# Altium schematic sheet Sheet1.SchDoc
size A
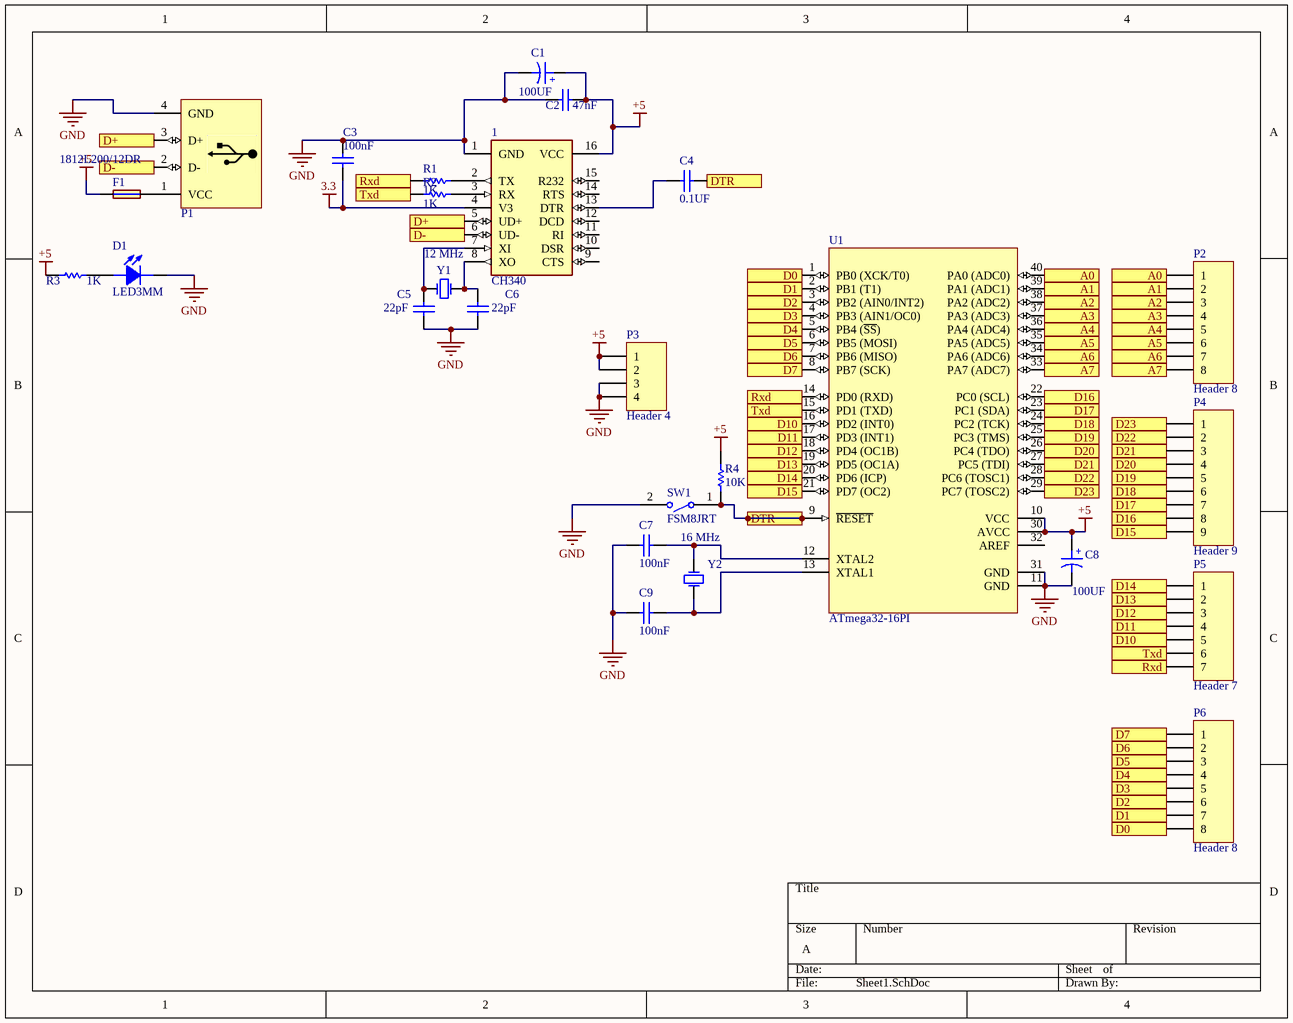
[diagram p0: Sheet1.SchDoc]

## Parts
1  CH340  [SOIC16]
C1  100UF  [Cap electrolitic radial 5x12-2]
C2  47nF  [Cap-100nF]
C3  100nF  [Cap-100nF]
C4  0.1UF  [CAPC3413X12N]
C5  22pF  [Cap-100nF]
C6  22pF  [Cap-100nF]
C7  100nF  [Cap-100nF]
C8  100UF  [Cap electrolitic radial 5x12-2]
C9  100nF  [Cap-100nF]
D1  LED3MM  [LED3mm_GRN]
F1  1812L200/12DR  [FUSE_1812L200/12DR]
P1  USB Connector  [USB2.5-2H4F]  (value not drawn)
P2  Header 8  [HDR1X8]
P3  Header 4  [HDR1X4]
P4  Header 9  [HDR1X9]
P5  Header 7  [HDR1X7]
P6  Header 8  [HDR1X8]
R1  1K  [RES1206]
R2  1K  [RES1206]
R3  1K  [RES-(1/4)]
R4  10K  [RES-(1/4)]
SW1  FSM8JRT  [TE_FSM8JRT]
U1  ATmega32-16PI  [40P6]
Y1  12 MHz  [XTAL 16MHZ]
Y2  16 MHz  [XTAL 16MHZ]

## Ports
A0, A1, A2, A3, A4, A5, A6, A7, D0, D1, D2, D3, D4, D5, D6, D7, D10, D11, D12, D13, D14, D15, D16, D17, D18, D19, D20, D21, D22, D23, D+, D-, DTR, Rxd, Txd

## Nets
3.3: 1.4(V3) C3.1
+5: 1.16(VCC) C1.1 C2.1 C8.1 F1.1 P3.1 P3.2 R3.1 R4.2 U1.10(VCC) U1.30(AVCC)
GND: 1.1(GND) C1.2 C2.2 C3.2 C5.1 C6.1 C7.2 C8.2 C9.2 D1.2(CATHODE) P1.4(GND) P3.3 P3.4 SW1.2 U1.11(GND) U1.31(GND)
A0: P2.1 U1.40(PA0_(ADC0)) ; port A0
A1: P2.2 U1.39(PA1_(ADC1)) ; port A1
A2: P2.3 U1.38(PA2_(ADC2)) ; port A2
A3: P2.4 U1.37(PA3_(ADC3)) ; port A3
A4: P2.5 U1.36(PA4_(ADC4)) ; port A4
A5: P2.6 U1.35(PA5_(ADC5)) ; port A5
A6: P2.7 U1.34(PA6_(ADC6)) ; port A6
A7: P2.8 U1.33(PA7_(ADC7)) ; port A7
D0: P6.8 U1.1(PB0_(XCK/T0)) ; port D0
D1: P6.7 U1.2(PB1_(T1)) ; port D1
D2: P6.6 U1.3(PB2_(AIN0/INT2)) ; port D2
D3: P6.5 U1.4(PB3_(AIN1/OC0)) ; port D3
D4: P6.4 U1.5(PB4_(~{SS})) ; port D4
D5: P6.3 U1.6(PB5_(MOSI)) ; port D5
D6: P6.2 U1.7(PB6_(MISO)) ; port D6
D7: P6.1 U1.8(PB7_(SCK)) ; port D7
D10: P5.5 U1.16(PD2_(INT0)) ; port D10
D11: P5.4 U1.17(PD3_(INT1)) ; port D11
D12: P5.3 U1.18(PD4_(OC1B)) ; port D12
D13: P5.2 U1.19(PD5_(OC1A)) ; port D13
D14: P5.1 U1.20(PD6_(ICP)) ; port D14
D15: P4.9 U1.21(PD7_(OC2)) ; port D15
D16: P4.8 U1.22(PC0_(SCL)) ; port D16
D17: P4.7 U1.23(PC1_(SDA)) ; port D17
D18: P4.6 U1.24(PC2_(TCK)) ; port D18
D19: P4.5 U1.25(PC3_(TMS)) ; port D19
D20: P4.4 U1.26(PC4_(TDO)) ; port D20
D21: P4.3 U1.27(PC5_(TDI)) ; port D21
D22: P4.2 U1.28(PC6_(TOSC1)) ; port D22
D23: P4.1 U1.29(PC7_(TOSC2)) ; port D23
D+: 1.5(UD+) P1.3(D+) ; port D+
D-: 1.6(UD-) P1.2(D-) ; port D-
DTR: C4.1 R4.1 SW1.1 U1.9(~{RESET}) ; port DTR
Rxd: P5.7 R1.1 U1.14(PD0_(RXD)) ; port Rxd
Txd: P5.6 R2.1 U1.15(PD1_(TXD)) ; port Txd
Net1_2: 1.2(TX) R1.2
Net1_3: 1.3(RX) R2.2
Net1_7: 1.7(XI) C5.2 Y1.1(OSC1)
Net1_8: 1.8(XO) C6.2 Y1.2(OSC2)
Net1_13: 1.13(DTR) C4.2
NetC7_1: C7.1 U1.12(XTAL2) Y2.2(OSC2)
NetC9_1: C9.1 U1.13(XTAL1) Y2.1(OSC1)
NetD1_1: D1.1(ANODE) R3.2
NetF1_2: F1.2 P1.1(VCC)

Not connected (* = marked no-connect by the designer): 1 9(CTS) 10(DSR) 11(RI) 12(DCD) 14(RTS) 15(R232); U1 32(AREF)

## Notes on the sheet
- (in symbol Cap ELECTROLITIC TOTAL SIZE) +

## Library data of the parts
1 = CH340: Circuit Breaker Magnetic 3Pole 40A 240VAC; MF: Eaton; Availability: Unavailable; Price: None; Package: None; Value: *; SnapEDA_Link: https://www.snapeda.com/parts/CH340/Eaton/view-part/4701946/?ref=snap; MP: CH340
C1 C8 = Cap ELECTROLITIC TOTAL SIZE: Cap electrolitic radial; Designer: Abbas Basereh; VALUE: 1uF; Data: 16-12-2016; Part. No: *
C2 C3 C5-C7 C9 = CAP CERAMIC TOTAL SIZE: CAP Ceramic Total; Designer: Ali Hafizi
C4 = CAP SMD 0805: CAP 0805; Designer: Abbas Basereh; Desc.: CAP SMD 0805; Data: 16-12-2016
D1 = LED 3MM: Light Emitting Diode; Designer: Ali Hafizi
F1 = 1812L200/12DR: Polymeric PTC Resettable Fuse 12V 2A Ih Surface Mount 1812 (4532 Metric), Concave; MF: Littelfuse Inc.; Mouser-Purchase-URL: https://snapeda.com/shop?store=Mouser&id=1314296; Value: *; Availability: Warning; Price: None; SnapEDA_Link: https://www.snapeda.com/parts/1812L200/12DR/Littelfuse%20Inc./view-part/1314296/?ref=snap; Package: 1812 Littelfuse; MP: 1812L200/12DR
P1 = USB B-Type: USB Connector-B Type; Adding Date: 10/26/2010
P2 P6 = Header 8: Header, 8-Pin; LatestRevisionDate: 17-Jul-2002; LatestRevisionNote: Re-released for DXP Platform.; Publisher: Altium Limited
P3 = Header 4: Header, 4-Pin; LatestRevisionDate: 17-Jul-2002; LatestRevisionNote: Re-released for DXP Platform.; Publisher: Altium Limited
P4 = Header 9: Header, 9-Pin; LatestRevisionDate: 17-Jul-2002; LatestRevisionNote: Re-released for DXP Platform.; Publisher: Altium Limited
P5 = Header 7: Header, 7-Pin; LatestRevisionDate: 17-Jul-2002; LatestRevisionNote: Re-released for DXP Platform.; Publisher: Altium Limited
R1 R2 = RES SMD PACKAGE: TOTAL SMD RESISTOR PACK; Designer: Abbas Basereh; Desc.: RES SMD PAKAGES; Data: 2017-3-10
R3 R4 = RES DIP PACKAGE: TOTAL DIP RESISTOR PACK; Designer: Ali Hafizi
SW1 = FSM8JRT: Switch Tactile OFF _ON_ SPST Round Button PC Pins 0.05A 12VDC 1.57N Thru-Hole Radial Tape; Contact_Current_Rating: 50 mA; MF: TE Connectivity; Configuration_Pole-Throw: Single Pole - Single Throw; Availability: Unavailable; Price: None; SnapEDA_Link: https://www.snapeda.com/parts/FSM8JRT/TE%20Connectivity%20ALCOSWITCH%20Switches/view-part/226999/?ref=snap; EU_RoHS_Compliance: Compliant; Value: *; Package: None; TE_purchase_URL: https://www.te.com/usa-en/product-147694-1.html?te_bu=Cor&te_type=disp&te_campaign=seda_glo_cor-seda-global-disp-prtnr-fy19-seda-model-bom-cta_sma-317_1&elqCampaignId=32493; MP: FSM8JRT
U1 = ATmega32-16PI: 8-Bit AVR Microcontroller with 32K Bytes of In-System Programmable Flash Memory; Published: 2017-1-4; DatasheetVersion: 2503C-AVR-10/02; PackageVersion: 2017-1-4; PackageReference: 40P6; Publisher: Abbas Basereh; PackageDescription: 40-lead (0.600"/15.24mm Wide) Plastic Dual Inline Package (PDIP); Supplier 1: Digi-Key; Supplier Part Number 1: ATMEGA32-16PI-ND; Supplier 2: Farnell; Supplier Part Number 2: 4376328; Supplier 3: Mouser; Supplier Part Number 3: 556-ATMEGA32-16PI; Code_JEDEC: MS-011-AC; ComponentLink1Description: Datasheet; ComponentLink1URL: http://www.atmel.com/dyn/resources/prod_documents/doc2503.pdf; ComponentLink2Description: Atmel.com Home; ComponentLink2URL: http://www.atmel.com
Y1 = XTAL: XTAL Crystal; Designer: ABBAS BASEREH; Design Date: 2017-1-3; ComponentLink1Description: Datasheet; ComponentLink2Description: Reference; Mounting Technology: Surface Mount\Through-Hole; Value: 12 MHz; Status: Unreleased
Y2 = XTAL: XTAL Crystal; Designer: ABBAS BASEREH; Value: 12 MHz; Design Date: 2017-1-3; ComponentLink1Description: Datasheet; ComponentLink2Description: Reference; Mounting Technology: Surface Mount\Through-Hole; Status: Unreleased